# Altium schematic sheet loaptrung.SchDoc
size A
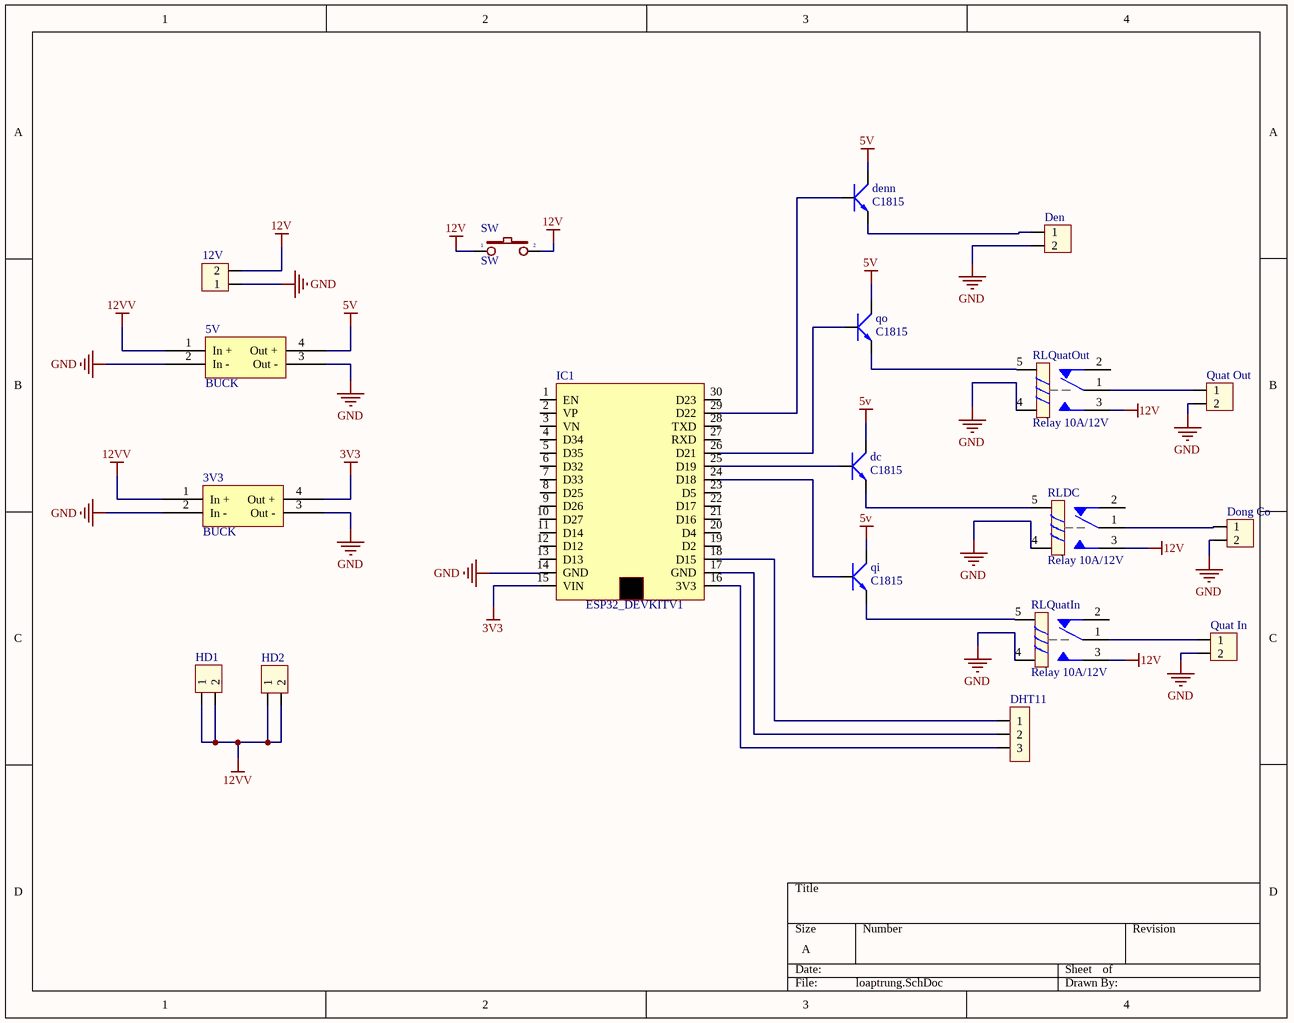
[diagram p0: loaptrung.SchDoc]

## Parts
3V3  BUCK  [buck - duplicate1]
5V  BUCK  [buck - duplicate1]
12V  Header 2  [HED2]  (value not drawn)
dc  C1815  [QTO-92]
Den  Header 2  [HED2]  (value not drawn)
denn  C1815  [QTO-92]
DHT11  Jumper 3  [JP3]  (value not drawn)
Dong_Co  Header 2  [HED2]  (value not drawn)
HD1  Header 2  [HED2]  (value not drawn)
HD2  Header 2  [HED2]  (value not drawn)
IC1  ESP32_DEVKITV1  [ESP32_DEVKITV1 - duplicate1]
qi  C1815  [QTO-92]
qo  C1815  [QTO-92]
Quat_In  Header 2  [HED2]  (value not drawn)
Quat_Out  Header 2  [HED2]  (value not drawn)
RLDC  Relay 10A/12V  [RL_SPDT_10A]
RLQuatIn  Relay 10A/12V  [RL_SPDT_10A]
RLQuatOut  Relay 10A/12V  [RL_SPDT_10A]
SW  SW  [SW2]

## Nets
3V3: 3V3.4(Out_+) IC1.15(VIN)
5V: 5V.4(Out_+) dc.2(C) denn.2(C) qi.2(C) qo.2(C)
12V: 12V.2 RLDC.3 RLQuatIn.3 RLQuatOut.3 SW.1 SW.2
12VV: 3V3.1(In_+) 5V.1(In_+) HD1.1 HD1.2 HD2.1 HD2.2
GND: 3V3.2(In_-) 3V3.3(Out_-) 5V.2(In_-) 5V.3(Out_-) 12V.1 Den.2 Dong_Co.2 IC1.14(GND) Quat_In.2 Quat_Out.2 RLDC.4 RLQuatIn.4 RLQuatOut.4
Netdc_1: dc.1(E) RLDC.5
Netdc_3: dc.3(B) IC1.25(D19)
NetDen_1: Den.1 denn.1(E)
Netdenn_3: denn.3(B) IC1.29(D22)
NetDHT11_1: DHT11.1 IC1.18(D15)
NetDHT11_2: DHT11.2 IC1.17(GND)
NetDHT11_3: DHT11.3 IC1.16(3V3)
NetDong_Co_1: Dong_Co.1 RLDC.1
NetIC1_24: IC1.24(D18) qi.3(B)
NetIC1_26: IC1.26(D21) qo.3(B)
Netqi_1: qi.1(E) RLQuatIn.5
Netqo_1: qo.1(E) RLQuatOut.5
NetQuat_In_1: Quat_In.1 RLQuatIn.1
NetQuat_Out_1: Quat_Out.1 RLQuatOut.1

Not connected (* = marked no-connect by the designer): IC1 1(EN) 2(VP) 3(VN) 4(D34) 5(D35) 6(D32) 7(D33) 8(D25) 9(D26) 10(D27) 11(D14) 12(D12) 13(D13) 19(D2) 20(D4) 21(D16) 22(D17) 23(D5) 27(RXD) 28(TXD) 30(D23); RLDC 2; RLQuatIn 2; RLQuatOut 2

## Library data of the parts
12V Den Dong_Co HD1 HD2 Quat_In Quat_Out = Hed2: Header 2 (Green); Value: Header 2
dc denn qi qo = C1815: NPN 600mW, ECB; Value: C1815
DHT11 = JP3: Value: J3
RLDC RLQuatIn RLQuatOut = Relay 1: Relay SPDT,10A - 12VDC 5 Pin; Value: Relay SPDT, 10A, 12V
SW = SW2: Switch button 2 pin; Value: SW chip 2 pin